# EAGLE design untitled (EAGLE 7.6.0)
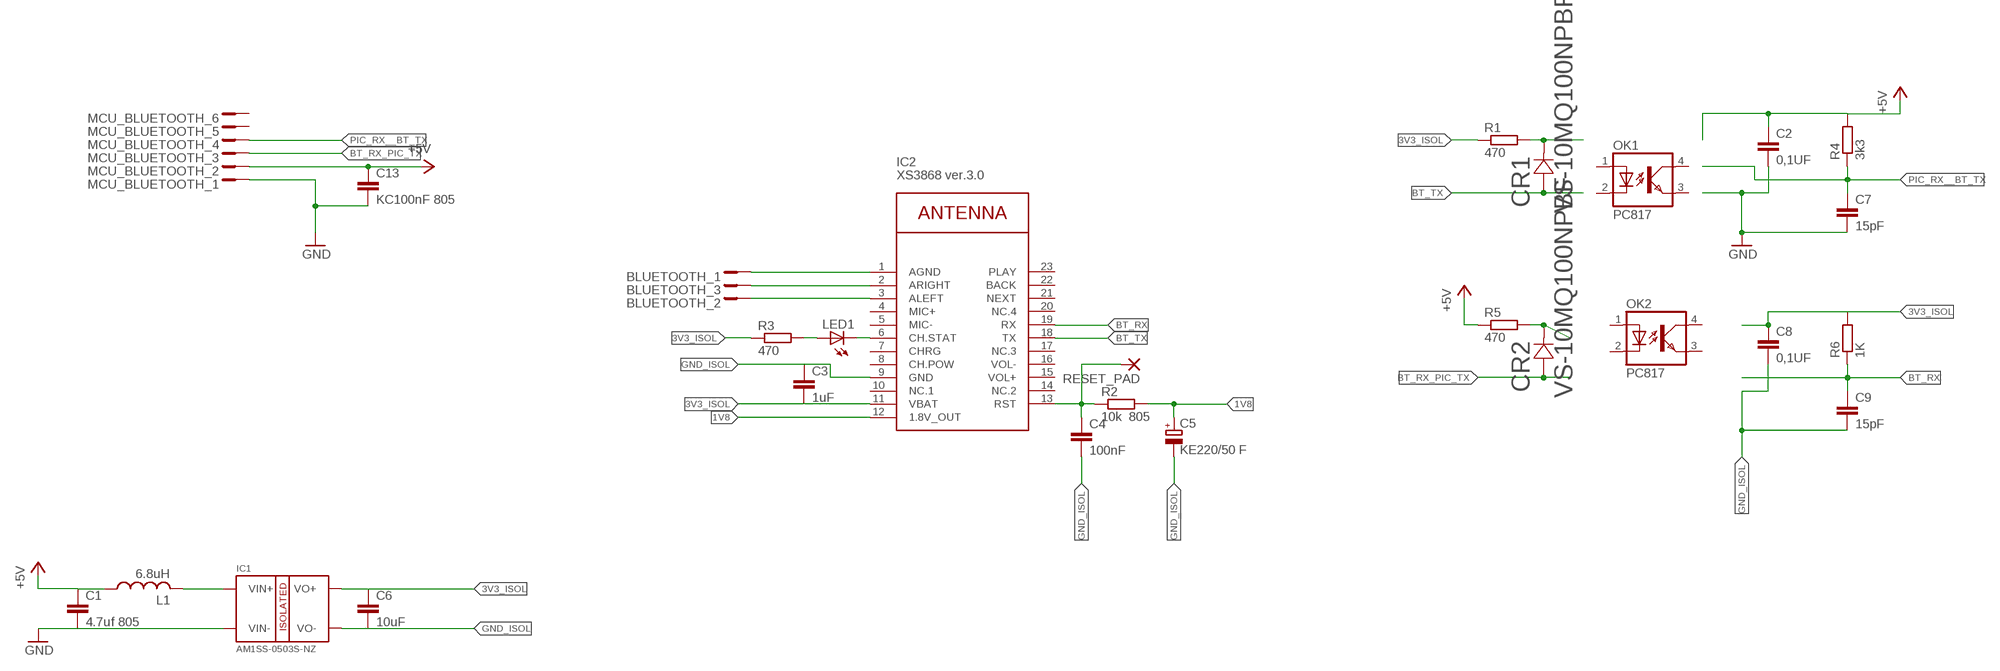
[diagram p0: schematic, sheet 1]

## Parts
BLUETOOTH  JST_3_PIN_B3B-PH-KS  [B3B-PH-KS]
C1  4.7uf 805  C-EUC0805  [C0805]
C2  0,1UF  C-EUC0805  [C0805]
C3  1uF  C-EUC0805  [C0805]
C4  100nF  C-EUC0805  [C0805]
C5  KE220/50 F  CPOL-EUG  [PANASONIC_G]
C6  10uF  C-EUC0805  [C0805]
C7  15pF  C-EUC0805  [C0805]
C8  0,1UF  C-EUC0805  [C0805]
C9  15pF  C-EUC0805  [C0805]
C13  KC100nF 805  C-EUC0805  [C0805]
CR1  VS-10MQ100NPBF  [DIODE_SMA]
CR2  VS-10MQ100NPBF  [DIODE_SMA]
IC1  AM1SS-0503S-NZ  [SIP4]
IC2  XS3868 ver.3.0  WIRELESS-BLUETOOTH-XS3868  [WIRELESS-BLUETOOTH-XS3868]
L1  6.8uH  L-US0204/5  [0204/5]
LED1  LEDSMART-LED  [SMART-LED]
MCU_BLUETOOTH  JST_6_PIN_B6B-PH-KS  [B6B-PH-KS]
OK1  PC817  [DIL04]
OK2  PC817  [DIL04]
R1  470  R-EU_M0805  [M0805]
R2  10k 805  R-EU_M0805  [M0805]
R3  470  R-EU_M0805  [M0805]
R4  3k3  R-EU_M0805  [M0805]
R5  470  R-EU_M0805  [M0805]
R6  1K  R-EU_M0805  [M0805]
RESET_PAD  SMD2  [SMD1,27-2,54]

## Nets
1V8: C5.+ IC2.12(1.8V_OUT) R2.2
3V3_ISOL: C3.2 C6.1 C8.1 IC1.P$3(VO+) IC2.11(VBAT) R1.1 R3.1 R6.2
+5V: C1.1 C2.1 C13.1 L1.1 MCU_BLUETOOTH.P$2 R4.2 R5.1
AGND: BLUETOOTH.P$1 IC2.1(AGND)
BT_LED: IC2.6(CH.STAT) LED1.B(C)
BT_RX: C9.1 IC2.19(RX) R6.1
BT_RX_PIC_TX: CR2.2 MCU_BLUETOOTH.P$3
BT_TX: CR1.2 IC2.18(TX)
BTOUT_LEFT: BLUETOOTH.P$2 IC2.3(ALEFT)
BTOUT_RIGHT: BLUETOOTH.P$3 IC2.2(ARIGHT)
GND: C1.2 C2.2 C7.2 C13.2 IC1.P$2(VIN-) MCU_BLUETOOTH.P$1
GND_ISOL: C3.1 C4.2 C5.- C6.2 C8.2 C9.2 IC1.P$4(VO-) IC2.9(GND)
N$1: IC1.P$1(VIN+) L1.2
N$2: CR1.1 R1.2
N$3: CR2.1 R5.2
N$5: LED1.A R3.2
PIC_RX__BT_TX: C7.1 MCU_BLUETOOTH.P$4 R4.1
RST: C4.1 IC2.13(RST) R2.1 RESET_PAD.1(P)
Unconnected: IC2.4(MIC+) IC2.5(MIC-) IC2.7(CHRG) IC2.8(CH.POW) IC2.10(NC.1) IC2.14(NC.2) IC2.15(VOL+) IC2.16(VOL-) IC2.17(NC.3) IC2.20(NC.4) IC2.21(NEXT) IC2.22(BACK) IC2.23(PLAY) MCU_BLUETOOTH.P$5 MCU_BLUETOOTH.P$6 OK1.1(A) OK1.2(C) OK1.3(EMIT) OK1.4(COL) OK2.1(A) OK2.2(C) OK2.3(EMIT) OK2.4(COL)

## Library data of the parts
BLUETOOTH = conn-JST:JST_3_PIN_
C1 C13 = rcl:C-EU: CAPACITOR, European symbol
C2-C4 C6-C9 = resistor:C-EU: CAPACITOR, European symbol
C5 = rcl:CPOL-EU: POLARIZED CAPACITOR, European symbol
CR1 CR2 = untitled:VS-10MQ100NPBF; MANUFACTURER_PART_NUMBER: VS10MQ100NPBF; VENDOR: Vishay
IC1 = DC-DC_converter:AM1SS
IC2 = diy-modules:WIRELESS-BLUETOOTH-XS3868: Bluetooth Stereo Audio Module based on OVC3860 chip More details available here: http://artofcircuits.com/product/bluetooth-2-0-edr-stereo-audio-ovc3860-module-model-xs-3868 Click here to find device on ebay.com <http://www.ebay.com/sch/xs3868+bluetooth+audio+module>
L1 = rcl:L-US: INDUCTOR, American symbol
LED1 = led:LED: LED OSRAM: - CHIPLED LG R971, LG N971, LY N971, LG Q971, LY Q971, LO R971, LY R971 LH N974, LH R974 LS Q976, LO Q976, LY Q976 LO Q996 - Hyper CHIPLED LW Q18S LB Q993, LB Q99A, LB R99A - SideLED LS A670, LO A670, LY A670, LG A670, LP A670 LB A673, LV A673, LT A673, LW A673 LH A674 LY A675 LS A676, LA A676, LO A676, LY A676, LW A676 LS A679, LY A679, LG A679 - Hyper Micro SIDELED® LS Y876, LA Y876, LO Y876, LY Y876 LT Y87S - SmartLED LW L88C, LW L88S LB L89C, LB L89S, LG L890 LS L89K, LO L89K, LY L89K LS L896, LA L896, LO L896, LY L896 - TOPLED LS T670, LO T670, LY T670, LG T670, LP T670 LSG T670, LSP T670, LSY T670, LOP T670, LYG T670 LG T671, LOG T671, LSG T671 LB T673, LV T673, LT T673, LW T673 LH T674 LS T676, LA T676, LO T676, LY T676, LB T676, LH T676, LSB T676, LW T676 LB T67C, LV T67C, LT T67C, LS T67K, LO T67K, LY T67K, LW E67C LS E67B, LA E67B, LO E67B, LY E67B, LB E67C, LV E67C, LT E67C LW T67C LS T679, LY T679, LG T679 LS T770, LO T770, LY T770, LG T770, LP T770 LB T773, LV T773, LT T773, LW T773 LH T774 LS E675, LA E675, LY E675, LS T675 LS T776, LA T776, LO T776, LY T776, LB T776 LHGB T686 LT T68C, LB T68C - Hyper Mini TOPLED® LB M676 - Mini TOPLED Santana® LG M470 LS M47K, LO M47K, LY M47K Source: http://www.osram.convergy.de LUXEON: - LUMILED® LXK2-PW12-R00, LXK2-PW12-S00, LXK2-PW14-U00, LXK2-PW14-V00 LXK2-PM12-R00, LXK2-PM12-S00, LXK2-PM14-U00 LXK2-PE12-Q00, LXK2-PE12-R00, LXK2-PE12-S00, LXK2-PE14-T00, LXK2-PE14-U00 LXK2-PB12-K00, LXK2-PB12-L00, LXK2-PB12-M00, LXK2-PB14-N00, LXK2-PB14-P00, LXK2-PB14-Q00 LXK2-PR12-L00, LXK2-PR12-M00, LXK2-PR14-Q00, LXK2-PR14-R00 LXK2-PD12-Q00, LXK2-PD12-R00, LXK2-PD12-S00 LXK2-PH12-R00, LXK2-PH12-S00 LXK2-PL12-P00, LXK2-PL12-Q00, LXK2-PL12-R00 Source: www.luxeon.com KINGBRIGHT: KA-3528ASYC Source: www.kingbright.com
MCU_BLUETOOTH = conn-JST:JST_6_PIN_
OK1 OK2 = optocoupler:PC817: SHARP OPTO COUPLER; MPN: PC817X4J000F; OC_FARNELL: 9707727; OC_NEWARK: 97K7059
R1-R6 = rcl:R-EU_: RESISTOR, European symbol
RESET_PAD = wirepad:SMD2: SMD PAD

## Board
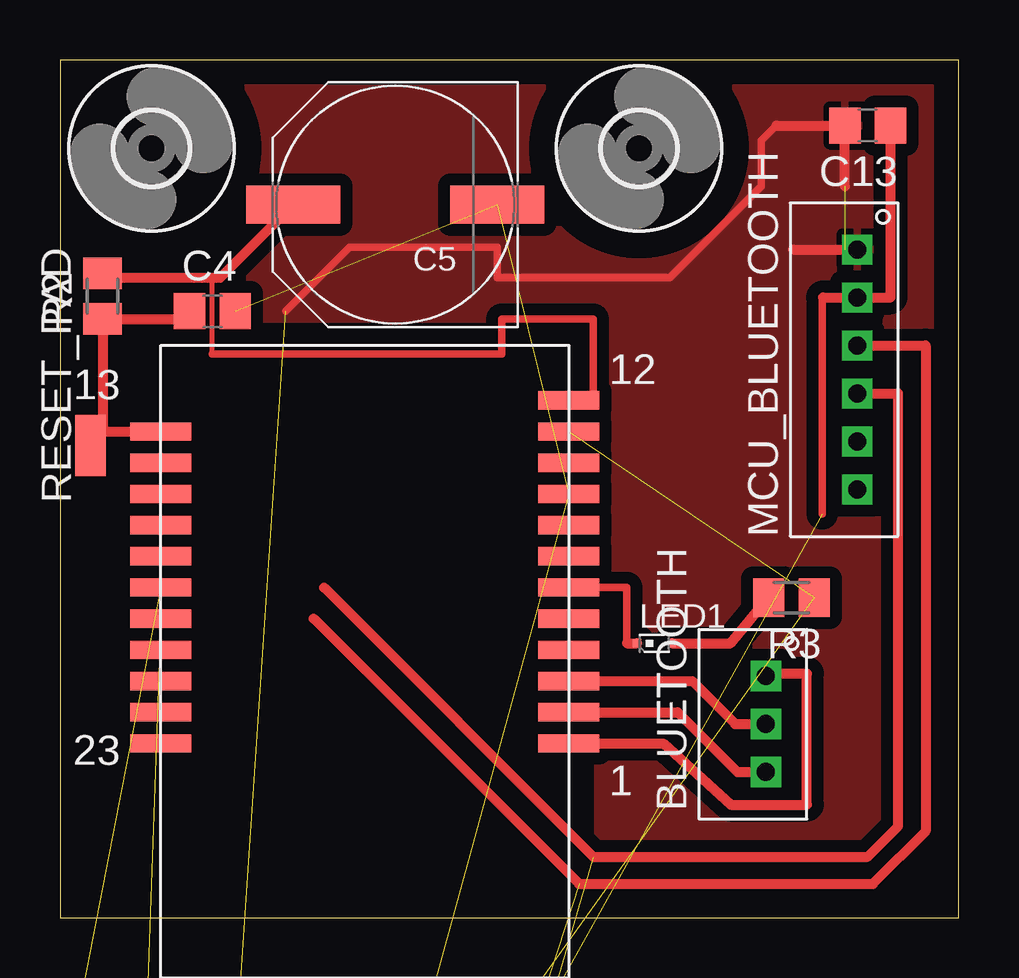
[diagram p1: board, top side]

Size 37.45 x 35.75 mm. Coordinates in mm from the lower left corner, seen from the top.
Outline: 0,0 37.45,0 37.45,35.75 0,35.75 0,0
Copper layers (1*16): Top 0.035mm / dielectric 1.5mm / Bottom 0.035mm
Design rules "default": minimum track width 10mil, minimum drill 24mil, track to track 8mil, track to pad 8mil, pad to pad 8mil, via to via 8mil, smd to smd 8mil, copper to edge 40mil, drill to drill 8mil, minimum pad ring 10mil, minimum via ring 8mil, stop-mask expansion 4mil, vias tented up to drill 0mil, thermal gap 10mil
tRestrict: area 3.8,-7 to 21.6,24.1

### Footprints (pad centres in the part's own frame; a part is rotated, then mirrored left to right if it is on the bottom)
B3B-PH-KS = drill 0.75 pad 1.2 square: P$1 -2,1.7; P$2 -4,1.7; P$3 -6,1.7
C0805 = smd 1.3 x 1.5: 1 -0.95,0; 2 0.95,0
PANASONIC_G = smd 3.9 x 1.6: + 4.25,0; - -4.25,0
DIODE_SMA = smd 2.184 x 1.575: 1 -1.702,0; 2 1.702,0
SIP4 = drill 0.6 square: P$1 -0.415,-2.91; P$2 2.035,-2.91; P$3 4.485,-2.91; P$4 6.935,-2.91
WIRELESS-BLUETOOTH-XS3868 = smd 2.54 x 0.762: 1 -8.5,0.995; 2 -8.5,-0.305; 3 -8.5,-1.605; 4 -8.5,-2.905; 5 -8.5,-4.205; 6 -8.5,-5.505; 7 -8.5,-6.805; 8 -8.5,-8.105; 9 -8.5,-9.405; 10 -8.5,-10.705; 11 -8.5,-12.005; 12 -8.5,-13.305; 13 8.5,-12.005; 14 8.5,-10.705; 15 8.5,-9.405; 16 8.5,-8.105; 17 8.5,-6.805; 18 8.5,-5.505; 19 8.5,-4.205; 20 8.5,-2.905; 21 8.5,-1.605; 22 8.5,-0.305; 23 8.5,0.995
0204/5 = drill 0.813 octagon: 1 -2.54,0; 2 2.54,0
SMART-LED = smd 0.35 x 0.35: A 0,0.725; B 0,-0.725
B6B-PH-KS = drill 0.75 pad 1.2 square: P$1 -2,1.7; P$2 -4,1.7; P$3 -6,1.7; P$4 -8,1.7; P$5 -10,1.7; P$6 -12,1.7
DIL04 = drill 0.813 offset: 1 -1.27,-3.81; 2 1.27,-3.81; 3 1.27,3.81; 4 -1.27,3.81
M0805 = smd 1.3 x 1.6: 1 -0.95,0; 2 0.95,0
SMD1,27-2,54 = smd 1.27 x 2.54: 1 0,0
3,0 = hole 3: 0,0

### Placement (x,y rotation side)
BLUETOOTH  31.12,12.06 90 top
C1  0.63,-40.64 0 top  (outside the outline)
C2  0.63,-81.28 0 top  (outside the outline)
C3  0.63,-34.29 0 top  (outside the outline)
C4  6.35,25.27 0 top
C5  13.97,29.72 180 top
C6  0.63,-27.94 0 top  (outside the outline)
C7  0.63,-87.63 0 top  (outside the outline)
C8  0.63,-107.95 0 top  (outside the outline)
C9  0.63,-120.65 0 top  (outside the outline)
C13  33.66,33.02 180 top
CR1  -27.3,-139.7 0 top  (outside the outline)
CR2  -27.3,-143.51 0 top  (outside the outline)
IC1  4.45,-15.24 0 top  (outside the outline)
IC2  12.7,8.25 180 top
L1  8.26,-50.8 0 top  (outside the outline)
LED1  24.77,11.43 270 top
MCU_BLUETOOTH  34.93,29.84 90 top
OK1  -10.79,-119.38 0 top  (outside the outline)
OK2  -27.3,-119.38 0 top  (outside the outline)
R1  0.63,-68.58 0 top  (outside the outline)
R2  1.78,25.91 90 top
R3  30.48,13.34 180 top
R4  0.63,-74.93 0 top  (outside the outline)
R5  0.63,-101.6 0 top  (outside the outline)
R6  0.63,-114.3 0 top  (outside the outline)
RESET_PAD  1.27,19.68 0 top
U$2  [3,0]  3.81,32.07 0 top
U$3  [3,0]  24.13,32.07 0 top

### Tracks (layer width: path | path; a pad name or v marks a point on that pad's centre or on a via)
1V8
  Top 0.203: 6.35,23.49 6.35,26.67
  Top 0.305: IC2.12 22.23,21.56 22.23,24.96 18.41,24.96 18.41,23.49 6.35,23.49
  Top 0.406: R2.2 1.78,26.67 6.35,26.67 6.67,26.67 C5.+
3V3_ISOL  (7 unrouted)
+5V  (5 unrouted)
  Top 0.305: 31.75,16.83 31.75,25.84 31.8,25.84
  Top 0.406: C13.1 34.61,25.84 MCU_BLUETOOTH.P$2 31.8,25.84
AGND
  Top 0.406: IC2.1 25.12,7.26 27.94,4.7 31.12,4.7 31.12,10.16 29.51,10.16 BLUETOOTH.P$1
BT_LED
  Top 0.305: IC2.6 23.62,13.76 23.62,11.43
  Top 0.406: 23.62,11.43 LED1.B
BT_RX  (2 unrouted)
BT_RX_PIC_TX  (1 unrouted)
  Top 0.406: MCU_BLUETOOTH.P$3 36.07,23.84 36.07,3.6 33.87,1.4 21.63,1.4 10.57,12.46
BT_TX  (1 unrouted)
BTOUT_LEFT
  Top 0.406: BLUETOOTH.P$2 28.13,8.06 26.34,9.86 IC2.3
BTOUT_RIGHT
  Top 0.406: IC2.2 25.73,8.56 28.23,6.06 BLUETOOTH.P$3
GND  (5 unrouted)
  Top 0.305: 32.39,33.02 C13.2 | 29.84,33.02 29.21,32.38 29.21,30.48 25.4,26.67 18.22,26.67 18.22,27.94 12.06,27.94 9.4,25.27 | 32.7,27.84 MCU_BLUETOOTH.P$1
  Top 0.406: 32.71,30.48 C13.2 29.84,33.02 | 30.54,27.84 MCU_BLUETOOTH.P$1
  pour Top (isolate 0.508): -1.9,36.83 38.73,36.83 38.73,-1.27 -1.9,-1.27
GND_ISOL  (7 unrouted)
N$1  (1 unrouted)
N$2  (1 unrouted)
N$3  (1 unrouted)
N$5
  Top 0.305: 29.53,12.7 R3.2
  Top 0.406: LED1.A 27.94,11.43 R3.2
PIC_RX__BT_TX  (2 unrouted)
  Top 0.406: 11.01,13.76 22.23,2.54 33.66,2.54 34.93,3.81 34.93,21.84 MCU_BLUETOOTH.P$4
RST
  Top 0.305: C4.1 5.4,24.96 | RESET_PAD.1 1.85,20.26
  Top 0.406: C4.1 5.08,24.96 R2.1 1.78,20.26 1.85,20.26 IC2.13